# EAGLE design usb2can (EAGLE 6.5.0)
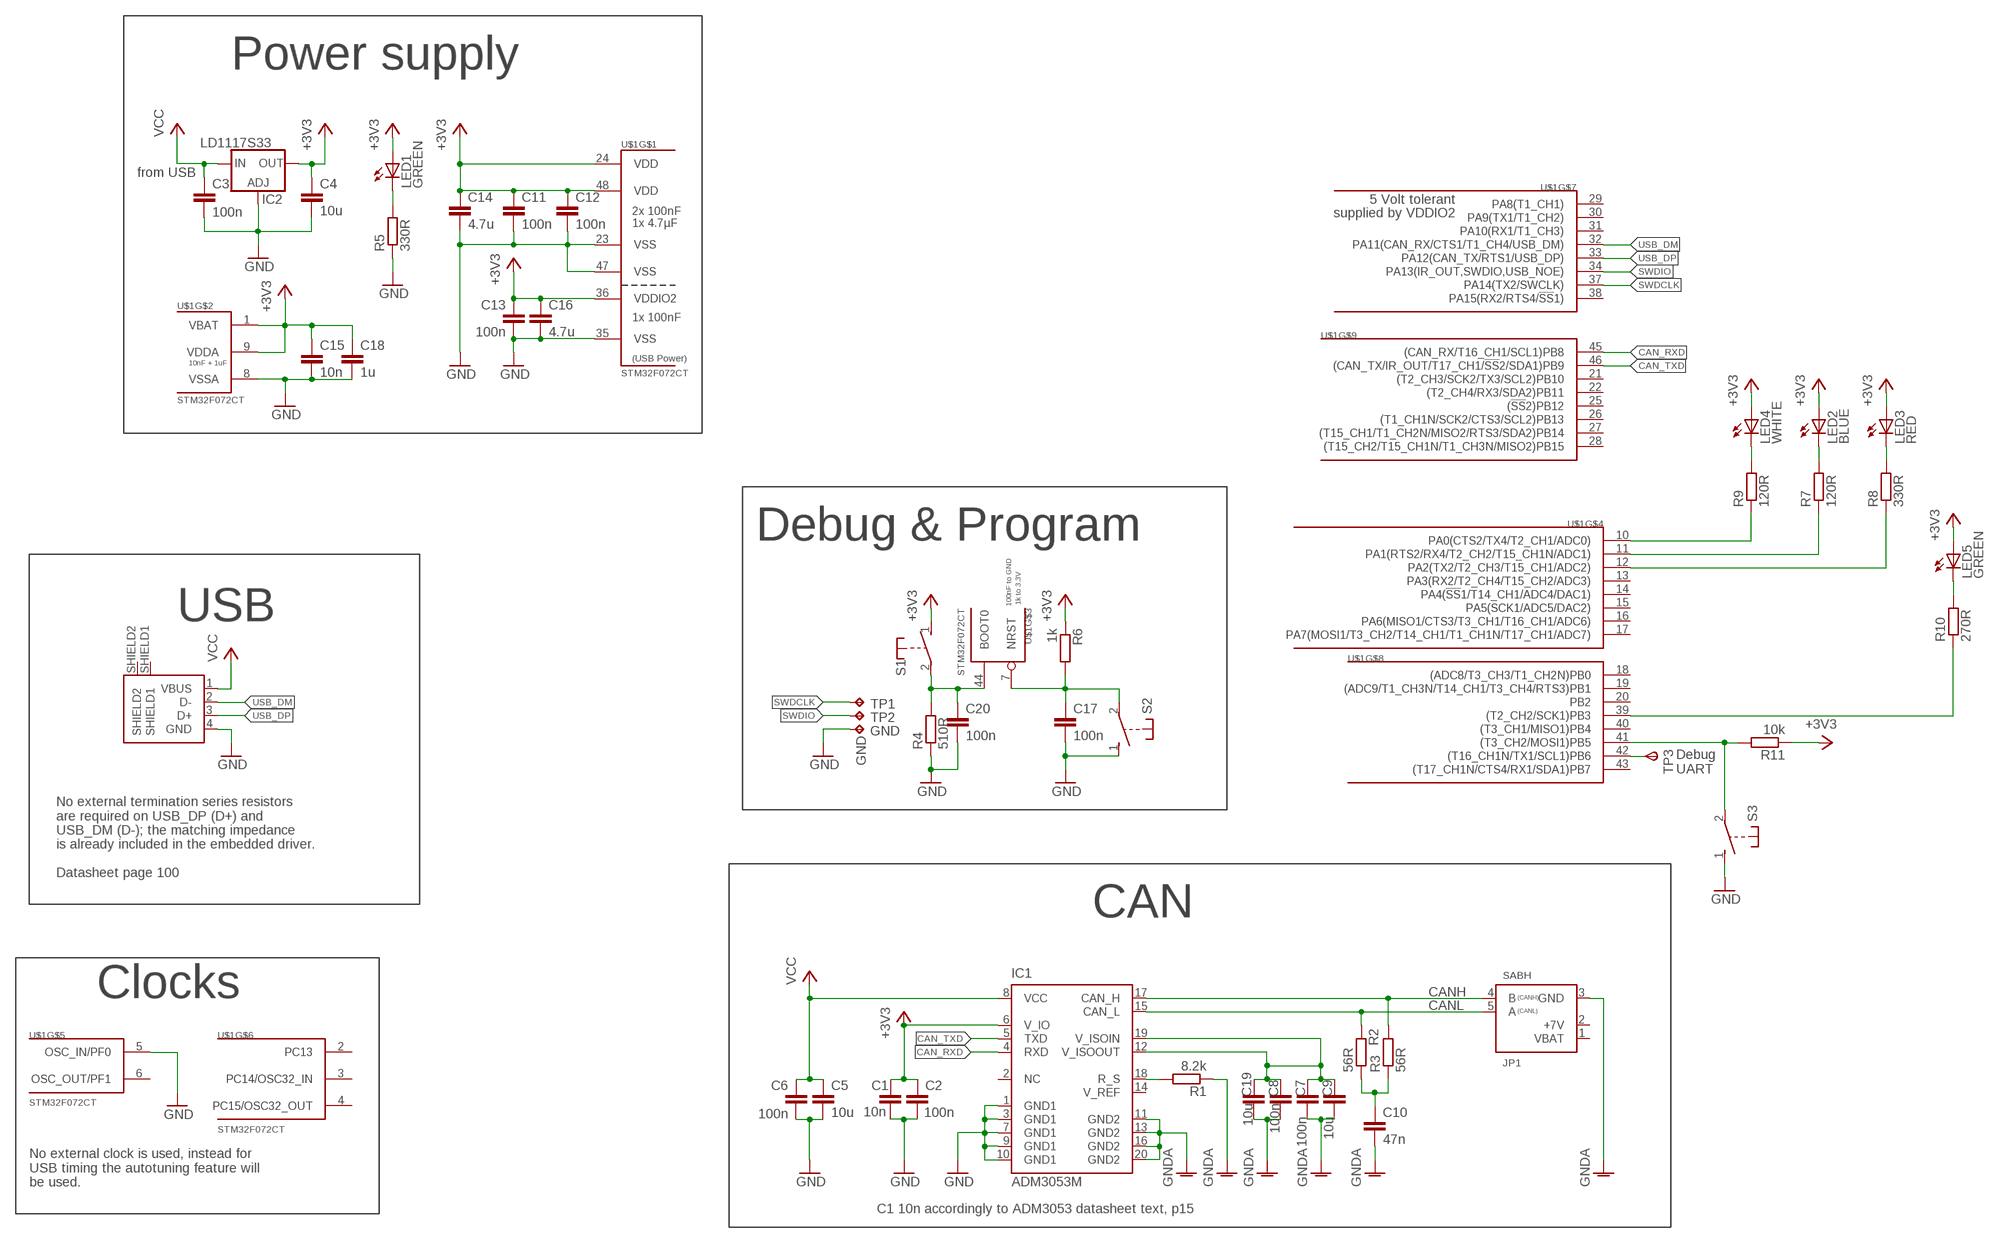
[diagram p0: schematic, sheet 1]

## Parts
C1  10n  C-EUC0603K  [C0603K]
C2  100n  C-EUC0603K  [C0603K]
C3  100n  C-EUC0603K  [C0603K]
C4  10u  C-EUC0805K  [C0805K]
C5  10u  C-EUC0805K  [C0805K]
C6  100n  C-EUC0603K  [C0603K]
C7  100n  C-EUC0805K  [C0805K]
C8  100n  C-EUC0805K  [C0805K]
C9  10u  C-EUC0805K  [C0805K]
C10  47n  C-EUC0603K  [C0603K]
C11  100n  C-EUC0603  [C0603]
C12  100n  C-EUC0603  [C0603]
C13  100n  C-EUC0603  [C0603]
C14  4.7u  C-EUC0805K  [C0805K]
C15  10n  C-EUC0603  [C0603]
C16  4.7u  C-EUC0805K  [C0805K]
C17  100n  C-EUC0603  [C0603]
C18  1u  C-EUC0805K  [C0805K]
C19  10u  C-EUC0805K  [C0805K]
C20  100n  C-EUC0603  [C0603]
CON1  USB_A_MALESMD  [USB_A_MALE_SMD]
GND  TPB2,54  [B2,54]
IC1  ADM3053M  [SO20W]
IC2  LD1117S33  LD117AS33TR  [SOT223]
JP1  SABH  [7395-05]
LED1  GREEN  LEDCHIPLED_0603  [CHIPLED_0603]
LED2  BLUE  LEDCHIPLED_0603  [CHIPLED_0603]
LED3  RED  LEDCHIPLED_0603  [CHIPLED_0603]
LED4  WHITE  LEDCHIPLED_0603  [CHIPLED_0603]
LED5  GREEN  LEDCHIPLED_0603  [CHIPLED_0603]
R1  8.2k  R-EU_R0603  [R0603]
R2  56R  R-EU_R0805  [R0805]
R3  56R  R-EU_R0805  [R0805]
R4  510R  R-EU_R0603  [R0603]
R5  330R  R-EU_R0603  [R0603]
R6  1k  R-EU_R0603  [R0603]
R7  120R  R-EU_R0603  [R0603]
R8  330R  R-EU_R0603  [R0603]
R9  120R  R-EU_R0603  [R0603]
R10  270R  R-EU_R0603  [R0603]
R11  10k  R-EU_R0603  [R0603]
S1  MICRO_SWITCH_3X6X2.5S  [MICRO_SWITCH_3X6X2.5]
S2  MICRO_SWITCH_3X6X2.5S  [MICRO_SWITCH_3X6X2.5]
S3  MICRO_SWITCH_3X6X2.5S  [MICRO_SWITCH_3X6X2.5]
TP1  TPB2,54  [B2,54]
TP2  TPB2,54  [B2,54]
TP3  TPSTP07R  [TP07R]
U$1  STM32F072CT  [TQFP48]

## Nets
+3V3: C1.1 C2.1 C4.1 C11.1 C12.1 C13.1 C14.1 C15.1 C16.1 C18.1 IC1.6(V_IO) IC2.4(OUT) LED1.A LED2.A LED3.A LED4.A LED5.A R6.1 R11.1 S1.1 U$1.1(VBAT) U$1.9(VDDA) U$1.24(VDD) U$1.36(VDDIO2) U$1.48(VDD)
CAN_RXD: IC1.4(RXD) U$1.45((CAN_RX/T16_CH1/SCL1)PB8)
CAN_TXD: IC1.5(TXD) U$1.46((CAN_TX/IR_OUT/T17_CH1/!SS!2/SDA1)PB9)
CANH: IC1.17(CAN_H) JP1.4(B) R3.2
CANL: IC1.15(CAN_L) JP1.5(A) R2.2
GND: C1.2 C2.2 C3.2 C4.2 C5.2 C6.2 C11.2 C12.2 C13.2 C14.2 C15.2 C16.2 C17.2 C18.2 C20.2 CON1.4(GND) GND.TP IC1.1(GND1) IC1.3(GND1) IC1.7(GND1) IC1.9(GND1) IC1.10(GND1) IC2.1(ADJ) R4.1 R5.1 S2.1 S3.1 U$1.5(OSC_IN/PF0) U$1.8(VSSA) U$1.23(VSS) U$1.35(VSS) U$1.47(VSS)
GNDA: C7.2 C8.2 C9.2 C10.2 C19.2 IC1.11(GND2) IC1.13(GND2) IC1.16(GND2) IC1.20(GND2) JP1.3(GND) R1.1
N$1: IC1.18(R_S) R1.2
N$4: C10.1 R2.1 R3.1
N$5: LED1.C R5.2
N$6: C20.1 R4.2 S1.2 U$1.44(BOOT0)
N$7: C17.1 R6.2 S2.2 U$1.7(NRST)
N$8: C7.1 C8.1 C9.1 C19.1 IC1.12(V_ISOOUT) IC1.19(V_ISOIN)
N$9: LED2.C R7.2
N$11: R11.2 S3.2 U$1.41((T3_CH2/MOSI1)PB5)
N$12: LED3.C R8.2
N$13: LED4.C R9.2
N$14: R9.1 U$1.10(PA0(CTS2/TX4/T2_CH1/ADC0))
N$15: R7.1 U$1.11(PA1(RTS2/RX4/T2_CH2/T15_CH1N/ADC1))
N$16: R8.1 U$1.12(PA2(TX2/T2_CH3/T15_CH1/ADC2))
N$17: LED5.C R10.2
N$18: R10.1 U$1.39((T2_CH2/SCK1)PB3)
SWDCLK: TP1.TP U$1.37(PA14(TX2/SWCLK))
SWDIO: TP2.TP U$1.34(PA13(IR_OUT,SWDIO,USB_NOE))
TX: TP3.TP(PP) U$1.42((T16_CH1N/TX1/SCL1)PB6)
USB_DM: CON1.2(D-) U$1.32(PA11(CAN_RX/CTS1/T1_CH4/USB_DM))
USB_DP: CON1.3(D+) U$1.33(PA12(CAN_TX/RTS1/USB_DP))
VCC: C3.1 C5.1 C6.1 CON1.1(VBUS) IC1.8(VCC) IC2.3(IN)
Unconnected: CON1.SHIELD1 CON1.SHIELD2 IC1.2(NC) IC1.14(V_REF) JP1.1(VBAT) JP1.2(+7V) U$1.2(PC13) U$1.3(PC14/OSC32_IN) U$1.4(PC15/OSC32_OUT) U$1.6(OSC_OUT/PF1) U$1.13(PA3(RX2/T2_CH4/T15_CH2/ADC3)) U$1.14(PA4(!SS!1/T14_CH1/ADC4/DAC1)) U$1.15(PA5(SCK1/ADC5/DAC2)) U$1.16(PA6(MISO1/CTS3/T3_CH1/T16_CH1/ADC6)) U$1.17(PA7(MOSI1/T3_CH2/T14_CH1/T1_CH1N/T17_CH1/ADC7)) U$1.18((ADC8/T3_CH3/T1_CH2N)PB0) U$1.19((ADC9/T1_CH3N/T14_CH1/T3_CH4/RTS3)PB1) U$1.20(PB2) U$1.21((T2_CH3/SCK2/TX3/SCL2)PB10) U$1.22((T2_CH4/RX3/SDA2)PB11) U$1.25((!SS!2)PB12) U$1.26((T1_CH1N/SCK2/CTS3/SCL2)PB13) U$1.27((T15_CH1/T1_CH2N/MISO2/RTS3/SDA2)PB14) U$1.28((T15_CH2/T15_CH1N/T1_CH3N/MISO2)PB15) U$1.29(PA8(T1_CH1)) U$1.30(PA9(TX1/T1_CH2)) U$1.31(PA10(RX1/T1_CH3)) U$1.38(PA15(RX2/RTS4/!SS!1)) U$1.40((T3_CH1/MISO1)PB4) U$1.43((T17_CH1N/CTS4/RX1/SDA1)PB7)

## Notes on the sheet
- Power supply
- from USB
- Debug & Program
- USB
- Debug
  UART
- No external termination series resistors
  are required on USB_DP (D+) and
  USB_DM (D-); the matching impedance 
  is already included in the embedded driver.
  
  Datasheet page 100
- CAN
- Clocks
- No external clock is used, instead for
  USB timing the autotuning feature will 
  be used.
- C1 10n accordingly to ADM3053 datasheet text, p15

## Library data of the parts
C1-C20 = rcl:C-EU: CAPACITOR, European symbol
CON1 = micro_switch:USB_A_MALE
GND = testpad:TP: Test pad; TP_SIGNAL_NAME: GND
IC1 = ADM3053:ADM3053: Signal and Power Isolated CAN Transceiver Analog Devices - Signal and Power Isolated CAN Transceiver with Integrated Isolated DC-to-DC Converter
IC2 = v-reg:LD117A?*: Low drop fixed and adjustable positive voltage regulators 1 A Source: http://www.st.com/stonline/products/literature/ds/7194/ld1117axx.pdf
JP1 = rca_stecker:SAB: Sensor Actor Bus Connector see xpcc::sab::Master and xpcc::sab::Slave at http://xpcc.sf.net/api
LED1-LED5 = led:LED: LED OSRAM: - CHIPLED LG R971, LG N971, LY N971, LG Q971, LY Q971, LO R971, LY R971 LH N974, LH R974 LS Q976, LO Q976, LY Q976 LO Q996 - Hyper CHIPLED LW Q18S LB Q993, LB Q99A, LB R99A - SideLED LS A670, LO A670, LY A670, LG A670, LP A670 LB A673, LV A673, LT A673, LW A673 LH A674 LY A675 LS A676, LA A676, LO A676, LY A676, LW A676 LS A679, LY A679, LG A679 - Hyper Micro SIDELED® LS Y876, LA Y876, LO Y876, LY Y876 LT Y87S - SmartLED LW L88C, LW L88S LB L89C, LB L89S, LG L890 LS L89K, LO L89K, LY L89K LS L896, LA L896, LO L896, LY L896 - TOPLED LS T670, LO T670, LY T670, LG T670, LP T670 LSG T670, LSP T670, LSY T670, LOP T670, LYG T670 LG T671, LOG T671, LSG T671 LB T673, LV T673, LT T673, LW T673 LH T674 LS T676, LA T676, LO T676, LY T676, LB T676, LH T676, LSB T676, LW T676 LB T67C, LV T67C, LT T67C, LS T67K, LO T67K, LY T67K, LW E67C LS E67B, LA E67B, LO E67B, LY E67B, LB E67C, LV E67C, LT E67C LW T67C LS T679, LY T679, LG T679 LS T770, LO T770, LY T770, LG T770, LP T770 LB T773, LV T773, LT T773, LW T773 LH T774 LS E675, LA E675, LY E675, LS T675 LS T776, LA T776, LO T776, LY T776, LB T776 LHGB T686 LT T68C, LB T68C - Hyper Mini TOPLED® LB M676 - Mini TOPLED Santana® LG M470 LS M47K, LO M47K, LY M47K Source: http://www.osram.convergy.de LUXEON: - LUMILED® LXK2-PW12-R00, LXK2-PW12-S00, LXK2-PW14-U00, LXK2-PW14-V00 LXK2-PM12-R00, LXK2-PM12-S00, LXK2-PM14-U00 LXK2-PE12-Q00, LXK2-PE12-R00, LXK2-PE12-S00, LXK2-PE14-T00, LXK2-PE14-U00 LXK2-PB12-K00, LXK2-PB12-L00, LXK2-PB12-M00, LXK2-PB14-N00, LXK2-PB14-P00, LXK2-PB14-Q00 LXK2-PR12-L00, LXK2-PR12-M00, LXK2-PR14-Q00, LXK2-PR14-R00 LXK2-PD12-Q00, LXK2-PD12-R00, LXK2-PD12-S00 LXK2-PH12-R00, LXK2-PH12-S00 LXK2-PL12-P00, LXK2-PL12-Q00, LXK2-PL12-R00 Source: www.luxeon.com KINGBRIGHT: KA-3528ASYC Source: www.kingbright.com
R1-R3 = rcl:R-EU_: RESISTOR, European symbol
R4-R11 = resistor:R-EU_: RESISTOR, European symbol
S1-S3 = micro_switch:MICRO_SWITCH_3X6X2.5
TP1 TP2 = testpad:TP: Test pad
TP3 = testpad:TPS: TEST PIN
U$1 = stm32:STM32F072C: STM32F072C ARM-based 32-bit MCU, up to 128 KB Flash, crystalless USB FS 2.0, CAN, 12 timers, ADC, DAC & comm. interfaces, 2.0 - 3.6 V WARNING: part not tested

## Net classes
0 default: clearance 0.205 mm

## Board
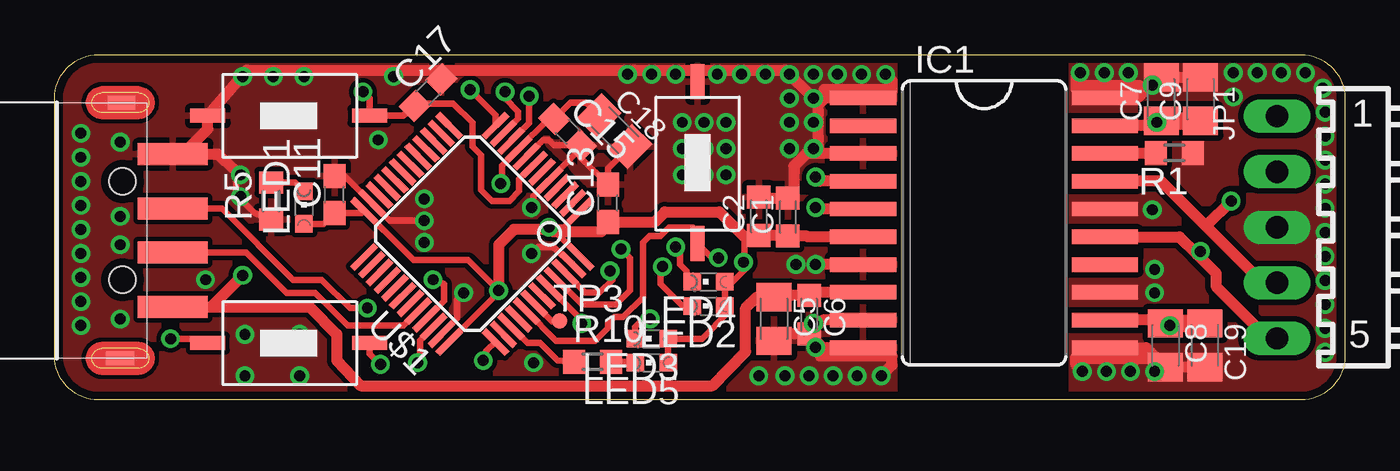
[diagram p1: board, top side]
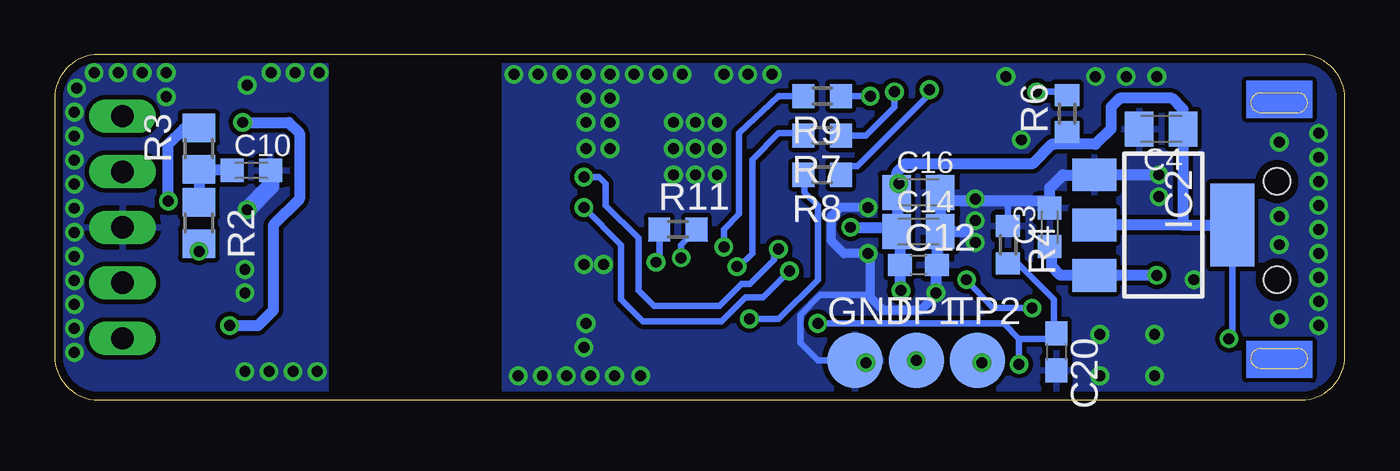
[diagram p2: board, bottom side, seen from below]

Size 59 x 15.8 mm. Coordinates in mm from the lower left corner, seen from the top.
Outline: 2,15.8 57,15.8 arc-90 59,13.8 59,2 arc-90 57,0 2,0 arc-90 0,2 0,13.8 arc-90 2,15.8
Copper layers (1*16): Top 0.0356mm / dielectric 1.5011mm / Bottom 0.0356mm
Design rules "OSHPARK *": minimum track width 6mil, minimum drill 13mil, track to track 6mil, track to pad 6mil, pad to pad 6mil, via to via 6mil, smd to smd 6mil, copper to edge 15mil, drill to drill 6mil, minimum pad ring 7mil, minimum via ring 7mil, stop-mask expansion 3mil, vias tented up to drill 999mil, thermal gap 10mil
bRestrict: area 10.5,8.9 to 12.5,9.3; area 10.5,6.6 to 12.5,7

### Footprints (pad centres in the part's own frame; a part is rotated, then mirrored left to right if it is on the bottom)
C0603K = smd 1.05 x 1.08: 1 -0.875,0; 2 0.875,0
C0805K = smd 1.3 x 1.6: 1 -1,0; 2 1,0
C0603 = smd 1.1 x 1: 1 -0.85,0; 2 0.85,0
USB_A_MALE_SMD = smd 1 x 3.2: 1 5.75,2.3; 2 3.25,2.3; 3 1.25,2.3; 4 -1.25,2.3 | smd 0.635 x 1.27: SHIELD1 -3.6,-0.05; SHIELD2 8.1,-0.1 | hole 1.2: 0,0; 4.5,0
B2,54 = smd 2.54 x 2.54: TP 0,0
SO20W = smd 0.66 x 3.032: 1 -5.715,-5.529; 2 -4.445,-5.529; 3 -3.175,-5.529; 4 -1.905,-5.529; 5 -0.635,-5.529; 6 0.635,-5.529; 7 1.905,-5.529; 8 3.175,-5.529; 9 4.445,-5.529; 10 5.715,-5.529; 11 5.715,5.529; 12 4.445,5.529; 13 3.175,5.529; 14 1.905,5.529; 15 0.635,5.529; 16 -0.635,5.529; 17 -1.905,5.529; 18 -3.175,5.529; 19 -4.445,5.529; 20 -5.715,5.529
SOT223 = smd 1.5 x 2: 1 -2.3,-3.15; 2 0,-3.15; 3 2.3,-3.15 | smd 3.8 x 2: 4 0,3.15
7395-05 = drill 1.016 long: 1 -5.08,0; 2 -2.54,0; 3 0,0; 4 2.54,0; 5 5.08,0
CHIPLED_0603 = smd 0.8 x 0.8: A 0,-0.75; C 0,0.75
R0603 = smd 1 x 1.1: 1 -0.85,0; 2 0.85,0
R0805 = smd 1.3 x 1.5: 1 -0.95,0; 2 0.95,0
MICRO_SWITCH_3X6X2.5 = smd 1.6 x 0.635: 1 -3.7,0; 2 3.7,0
TP07R = smd 0.7 x 0.7: TP 0,0
TQFP48 = smd 0.3 x 1.5: 1 -2.75,-4.25; 2 -2.25,-4.25; 3 -1.75,-4.25; 4 -1.25,-4.25; 5 -0.75,-4.25; 6 -0.25,-4.25; 7 0.25,-4.25; 8 0.75,-4.25; 9 1.25,-4.25; 10 1.75,-4.25; 11 2.25,-4.25; 12 2.75,-4.25; 25 2.75,4.25; 26 2.25,4.25; 27 1.75,4.25; 28 1.25,4.25; 29 0.75,4.25; 30 0.25,4.25; 31 -0.25,4.25; 32 -0.75,4.25; 33 -1.25,4.25; 34 -1.75,4.25; 35 -2.25,4.25; 36 -2.75,4.25 | smd 1.5 x 0.3: 13 4.25,-2.75; 14 4.25,-2.25; 15 4.25,-1.75; 16 4.25,-1.25; 17 4.25,-0.75; 18 4.25,-0.25; 19 4.25,0.25; 20 4.25,0.75; 21 4.25,1.25; 22 4.25,1.75; 23 4.25,2.25; 24 4.25,2.75; 37 -4.25,2.75; 38 -4.25,2.25; 39 -4.25,1.75; 40 -4.25,1.25; 41 -4.25,0.75; 42 -4.25,0.25; 43 -4.25,-0.25; 44 -4.25,-0.75; 45 -4.25,-1.25; 46 -4.25,-1.75; 47 -4.25,-2.25; 48 -4.25,-2.75

### Placement (x,y rotation side)
C1  33.53,8.37 90 top
C2  32.2,8.4 90 top
C3  13.5,7.9 90 bottom
C4  8.4,12.4 180 bottom
C5  32.9,3.7 270 top
C6  34.5,3.9 270 top
C7  50.6,13.76 90 top
C8  50.8,2.5 270 top
C9  52.4,13.76 90 top
C10  50,10.5 0 bottom
C11  12.8,9.4 90 top
C12  19.5,6.18 0 bottom
C13  25.3,9 90 top
C14  19.5,7.7 0 bottom
C15  23.46,12.26 315 top
C16  19.5,9.5 0 bottom
C17  17.08,14.06 45 top
C18  25.6,12.3 315 top
C19  52.6,2.5 270 top
C20  13.2,2.2 270 bottom
CON1  3.1,10 270 top
GND  22.4,1.8 0 bottom
IC1  42.5,8.1 270 top
IC2  8.3,8 270 bottom
JP1  55.9,7.9 270 top
LED1  11.4,8.8 0 top
LED2  29.9,4.3 90 top
LED3  27.3,2.8 90 top
LED4  29.9,5.4 90 top
LED5  27.3,1.7 90 top
R1  51.2,11.3 180 top
R2  52.4,8.1 270 bottom
R3  52.4,11.5 90 bottom
R4  15.4,7.1 270 bottom
R5  9.9,9.1 90 top
R6  12.7,13.1 90 bottom
R7  23.9,12.1 180 bottom
R8  23.9,10.3 180 bottom
R9  23.9,13.9 180 bottom
R10  24.6,1.75 0 top
R11  30.5,7.8 0 bottom
S1  10.7,2.6 0 top
S2  10.7,13 0 top
S3  29.4,10.86 270 top
TP1  19.6,1.8 0 bottom
TP2  16.8,1.8 0 bottom
TP3  23.08,3.62 0 top
U$1  19.1,7.6 135 top
U$2  [LOGO_SILK_BOT]  42.4,11.9 0 top

### Tracks (layer width: path | path; a pad name or v marks a point on that pad's centre or on a via)
+3V3  (via drill 0.5)
  Top 0.3: S1.1 6.8,2.8 v5.3,2.8 | U$1.36 20.3,4.91 v20.3,5 18.9,6.4 16.41,6.4 U$1.24 | C18.1 24.69,13.21 24.3,13.6 23.6,13.6 C15.1 22.59,12.86 U$1.9 20.46,10.73 20.46,9.96 v20.4,9.9 | C11.1 14.04,8.55 U$1.24 | U$1.1 23.3,7.9 22.7,7.9 | 22.7,7.9 v22.6,7.9 22.5,7.8 | U$1.48 22.7,7.9 | U$1.24 15,7.8 | 12.6,8.75 C11.1 | LED1.A 12.3,8.05 C11.1 | LED5.A LED3.A 29.6,2.8 30.8,4 30.8,4.55 LED2.A LED4.A 31,5.4 31.6,6 v31.5,6.3 31.55,6.35 31.55,7.38 arc-45 31.5,7.5
  Top 0.5: IC1.6 34.44,7.46 34.4,7.5 C1.1 33.5,7.53 C2.1 32.17,7.5 31.5,7.5 30.4,8.6 27.9,8.6 27.45,8.15 25.45,8.15 | v22.6,7.9 22.8,7.7 25,7.7 25.45,8.15 | 25.45,8.15 C13.1 | 22.5,7.8 21,7.8 20.3,7.1 v20.3,5
  Bottom 0.3: v5.3,2.8 5.15,2.95 IC2.4 | C12.1 20.5,6.33 | C16.1 20.5,9.8 v20.4,9.9 | R6.1 12.75,12.25 13.3,11.7 | v31.5,6.3 31.35,6.45 R11.1
  Bottom 0.5: 7.4,8 C4.1 7.4,13.3 7.9,13.8 10.3,13.8 10.7,13.4 10.7,12.4 11.4,11.7 13.3,11.7 13.4,11.7 14.3,10.8 20.1,10.8 20.5,10.4 20.5,10 v20.4,9.9 C14.1 | 7.4,8 IC2.4 | C14.1 20.35,7.55 C12.1 20.35,4.95 v20.3,5 | v22.6,7.9 20.7,7.9 C14.1 | 7.4,8 11.28,8 arc45 LED1.A
CAN_RXD  (via drill 0.5)
  Top 0.3: U$1.45 24.11,4.36 25.66,4.36 26.3,5 26.3,6.5 v25.9,6.9
  Top 0.5: IC1.4 34.99,10.01 v34.8,10.2
  Bottom 0.3: v25.9,6.9 26.1,6.9 26.1,6.4 27.2,5.3 27.6,5.3 28.6,4.3 31.6,4.3 32.3,5 32.3,7.4 33.8,8.9 33.8,9.9 34.1,10.2 v34.8,10.2
CAN_TXD  (via drill 0.5)
  Top 0.3: U$1.46 24.26,4.92 24.92,4.92 25.5,5.5 25.5,5.8 v25.4,5.9
  Top 0.5: IC1.5 34.87,8.73 v34.8,8.8
  Bottom 0.3: v25.4,5.9 26.6,4.7 27.4,4.7 28.5,3.6 32.1,3.6 33.1,4.6 33.1,7.1 v34.8,8.8
CANH  (via drill 0.5)
  Top 0.5: IC1.17 50.59,10.01 52.65,7.95 | v53.8,9.1 52.65,7.95 | 52.65,7.95 55.24,5.36 JP1.4
  Bottom 0.5: 52.55,12.45 R3.2 52.45,12.4 53.1,12.4 53.8,11.7 v53.8,9.1
CANL  (via drill 0.5)
  Top 0.5: IC1.15 51.44,7.46 52.25,6.65 | 52.25,6.65 53.1,5.8 53.1,5.2 55.48,2.82 JP1.5 | v52.4,6.8 52.25,6.65
  Bottom 0.5: 52.45,7.2 R2.2 v52.4,6.8
GND  (via drill 0.5)
  Top 0: C17.2 17.68,15.08 17.7,15.1
  Top 0.3: U$1.35 18.4,3.72 18.4,4.6 v18.7,4.9 | 13.22,10.3 U$1.23 15.32,8.2 v16.9,8.2 | v21.8,8.8 21.9,8.9 21.9,9.34 U$1.5 24.06,11.5 C15.2 | U$1.47 22.78,7 22.1,7 v21.8,6.7 | R5.1 9.15,8.55 8.3,9.4 8.3,10.2 v8.5,10.3 | 26.55,15.05 26.5,15.1 | U$1.8 22.34,11.9 22.6,11.9 22.84,11.66 C15.2 | C15.2 24.06,11.09 C13.2 25.3,10.59 C18.2
  Top 0.5: CON1.4 5.85,11.25 | 5.85,11.25 7.45,11.25 v8.5,10.3 | 5.85,11.25 7,12.4 S2.1 8.8,15.1 17.7,15.1 26.5,15.1 29.3,15.1 | 29.3,15.1 33.4,15.1 v34.7,13.8 34.9,13.7 34.9,13.5 | IC1.9 35.13,3.65 C6.2 | C6.2 33.23,3.02 C5.2 | IC1.10 35.14,2.38 C6.2 | IC1.7 v34.8,6.2 | IC1.3 34.9,11.28 | 34.83,11.28 34.38,11.28 33.8,10.7 33.8,9.34 C1.2 32.33,9.25 C2.2 | IC1.1 35.22,13.81 34.9,13.5 | 34.9,13.5 34.9,11.28 | 34.9,11.28 34.83,11.28 | 34.83,11.28 v34.7,11.5 | S3.1 29.4,15 29.3,15.1 | v38,14.9 38.3,14.6 38.3,14.1 38.2,14.2 35.2,14.2 | v37.8,1.1 38.3,1.6 38.3,2 35,2
  Bottom 0.3: C12.2 18.5,6.33 | R4.1 15.4,9 15.3,9.1 | v21.9,1.7 23.6,1.8 24.1,1.8 24.9,2.6 24.9,3.9 24,4.8 21.8,4.8 21.7,4.9
  Bottom 0.4: v18.7,4.9 18.7,4.8 19.4,4.1 21.1,4.1 21.7,4.7 21.7,4.9 21.7,6.6 v21.8,6.7 22.9,6.7 23.5,7.3 23.5,8.4 23.1,8.8 v21.8,8.8
  Bottom 0.5: v8.5,10.3 IC2.1 12.9,10.3 13.5,9.7 13.5,9.1 | C3.2 13.5,9.1 | C4.2 9.4,12.35 | C14.2 C16.2 18.1,9.1 15.3,9.1 13.5,9.1 | C14.2 18.65,7.55 C12.2 18.7,6.13 v18.7,4.9 | C14.2 17.4,7.7 v16.9,8.2
  other vias: 34.8,2.4 34.7,3.5 36.9,14.9 35.8,14.9 34.7,14.9 34.7,12.7 33.9,6.2 36.7,1.1 35.6,1.1 34.5,1.1 33.4,1.1 32.2,1.1 33.6,14.9 32.5,14.9 33.6,13.8 33.6,12.7 33.6,11.5 31.4,14.9 30.3,14.9 28.4,14.9 27.3,14.9 26.2,14.9 8.6,14.8 1.2,12.2 1.2,11.1 1.2,10 1.2,8.9 1.2,7.8 1.2,6.7 1.2,5.6 1.2,4.5 1.2,3.4 11.2,3 8.7,3 8.7,1.1 11.2,1.1 6.9,5.5 14.8,11.9 16.9,9.2 16.9,7.2 11.4,14.8 15.5,14.8 10,14.8 8.5,9.3 3,8.4 3,7.1 3,3.7 3,11.8 30.7,12.7 29.7,12.7 28.7,12.7 30.7,11.5 29.7,11.5 28.7,11.5 28.7,10.3 29.7,10.3 30.7,10.3
  pour Bottom: -0.7,17.2 37.77,17.2 arc-90 38.4,16.57 38.4,-3.2 -0.07,-3.2 arc-90 -0.7,-2.56
  pour Top: -0.7,17.2 38.4,17.2 38.4,-3.2 -0.7,-3.2
GNDA  (via drill 0.5)
  Top 0.5: C9.2 C7.2 50.5,14.7 50.2,14.5 49.52,13.81 IC1.20 | C19.2 C8.2 49.91,2.38 IC1.11 | v49.2,1.3 49.3,1.4 49.3,2 | v46.9,14.98 46.7,14.78 46.7,14.2 46.9,14.4 49.6,14.4 | v47,1.3 46.7,1.6 46.7,2 46.8,1.9 49.9,1.9
  Bottom 0.8: C10.2 49.12,9.78 v50.2,8.7
  other vias: 50.3,1.3 50.2,14.4 48,14.97 49.1,14.97 48.1,1.3 50.3,4.9 53.9,14.97 55,14.97 56.1,14.97 57.2,14.97 58,14.27 58.1,13.17 58.1,12.07 58.1,10.97 58.1,9.87 58.1,8.77 58.1,7.67 58.1,6.57 58.1,5.47 58.1,4.37 58.1,3.27 58.1,2.17 50.3,5.97 53.9,13.87
  pour Top (isolate 0.254, no thermals): 46.6,15.8 46.6,0 59,0 59,15.8
  pour Bottom: 46.6,17.1 46.6,-3.2 66.2,-3.2 66.2,17.1
N$1
  Top 0.3: IC1.18 48.05,11.3
  Top 0.5: 48.05,11.3 R1.2
N$4
  Bottom 0.5: R2.1 R3.1 50.92,10.55 C10.1
N$5
  Top 0.3: R5.2 11,9.95 LED1.C
N$6  (via drill 0.5)
  Top 0.3: S1.2 14.4,2.1 v14.9,1.63 | U$1.44 24.26,3.5 v24.1,3.5
  Bottom 0.3: 14.9,2.8 15.6,3.5 v24.1,3.5 | 14.9,2.8 v14.9,1.63 | R4.2 14.95,6.25 13.3,4.6 13.3,3.4 13.4,3.3 13.4,2.8 14.9,2.8
  Bottom 0.5: C20.1 arc-45 13.23,3.13 13.4,3.3
N$7  (via drill 0.5)
  Top 0.3: U$1.7 21.25,10.1 21.25,9.55 20.8,9.1 20,9.1 19.5,9.6 19.5,11.2 19.1,11.6 19.1,12.7 18.21,13.56 16.55,13.56 C17.1 15.94,13 S2.2 14.4,13.8 v14.1,14.1
  Bottom 0.3: v14.1,14.1 12.85,14.1 R6.2
N$8  (via drill 0.5)
  Top 0.5: IC1.12 50.45,3.65 50.55,3.75 C8.1 50.9,3.5 v51,3.4 | C7.1 50.34,12.54 | 50.34,12.54 IC1.19 | 50.34,12.54 50.4,12.54 v50.4,12.7
  Top 0.8: C8.1 C19.1 | C9.1 C7.1
  Bottom 0.5: v50.4,12.7 48.3,12.7 47.8,12.2 47.8,9.2 49,8 49,4.1 49.7,3.4 v51,3.4
N$9  (via drill 0.5)
  Top 0.3: v27.8,6.1 27.7,6 27.7,5.3 28.7,4.3 LED2.C
  Bottom 0.3: v27.8,6.1 27.7,6.1 27.1,6.7 27.1,11 25.9,12.2 24.85,12.2 R7.2
N$11  (via drill 0.5)
  Top 0.3: U$1.41 22.94,2.7 24.7,2.7 25.3,3.3 25.3,3.5 25.6,3.8 26,3.8 26.9,4.7 26.9,7.2 27.2,7.5 27.7,7.5 28.1,7.9 29.2,7.9 29.4,7.7 S3.2 30.06,6.5 v30.35,6.5
  Bottom 0.3: R11.2 30.35,7.1 v30.35,6.5
N$12  (via drill 0.5)
  Top 0.3: LED3.C 26.55,3.35 26.9,3.7 v27.22,3.7 v27.23,3.71
  Bottom 0.3: R8.2 24.7,10.25 24.7,9.5 24.1,8.9 24.1,5.5 25.89,3.71 v27.23,3.71
N$13  (via drill 0.5)
  Top 0.3: 29.2,5.7 LED4.C 28.9,5.7 28.9,5.9 28.6,6.2 28.6,7 v28.4,7
  Bottom 0.3: v28.4,7 28.4,7.8 27.7,8.5 27.7,12.2 25.9,13.9 R9.2
N$14  (via drill 0.5)
  Top 0.3: v21.7,13.9 21.7,12.68 U$1.10
  Bottom 0.3: v21.7,13.9 R9.1
N$15  (via drill 0.5)
  Top 0.3: 20.51,12.21 U$1.11 21.2,12.88 21.2,13.2 20.6,13.8 v20.6,14.1
  Bottom 0.3: 20.8,14.1 v20.6,14.1 20.6,13.4 21.9,12.1 R7.1
N$16  (via drill 0.5)
  Top 0.3: U$1.12 20.16,13.04 v19,14.2
  Bottom 0.3: v19,14.2 19,14 22.3,10.7 22.8,10.7 R8.1
N$17
  Top 0.3: R10.2 26.5,1.75 LED5.C
N$18
  Top 0.3: U$1.39 21.62,2.6 22.2,2.6 23,1.8 R10.1
SWDCLK  (via drill 0.5)
  Top 0.3: U$1.37 19.76,2.26 TP1.TP
  Bottom 0.3: 19.8,2 TP1.TP
  other vias: 19.6,1.8
SWDIO  (via drill 0.5)
  Top 0.3: 17.36,3.36 U$1.34 16.7,2.73 16.7,2.1 v16.6,1.7
  Bottom 0.3: v16.6,1.7 TP2.TP
TX
  Top 0.3: TP3.TP 22.75,3.6 U$1.42
USB_DM
  Top 0.3: CON1.2 8.75,6.75 10.6,4.9 11.9,4.9 13.4,3.4 15.96,3.4 U$1.32
USB_DP  (via drill 0.5)
  Top 0.3: CON1.3 7.65,8.75 10.9,5.5 12.2,5.5 13.5,4.2 v14.3,4.2 | v17.3,5.5 17.8,5.3 17.8,4.53 U$1.33
  Bottom 0.3: v14.3,4.2 16.1,4.2 v17.3,5.5
VCC  (via drill 0.5)
  Top 0.5: CON1.1 7.15,4.25 | 7.15,4.25 v8.6,5.7 | 7.15,4.25 11.65,4.25 12.9,3 12.9,1.8 13.99,0.65 30.09,0.65 31.6,2.2 31.6,4.2 32.1,4.7 C5.1 | IC1.8 34.65,4.92 C6.1 32.98,4.78 C5.1 | 32.8,4.6 C5.1
  Bottom 0.5: v8.6,5.7 IC2.3 13,5.7 13.4,6.1 13.4,6.92 C3.1
(copper drawn outside any net)
  shapes: Bottom area x2

### Text on the board
tSilk: RST | MODE | GND | CANH | MODE | RX | DFU | TX | CANL
bSilk: 2017 | SWD | HW: Daniel | IO | CLK | xpcc.io | GND | Rev. 3